# Altium schematic sheet debug.SchDoc: Scalony Skaner Bioimpedancji
size A4; DrawnBy: Łukasz Przeniosło; Organization: Zachodniopomorski; Address1: Uniwersytet Technologiczny; Address2: w Szczecinie; Address3: Wydział Elektryczny; Address4: Katedra KISSE; Revision: 1.0; SheetNumber: 7; SheetTotal: 7
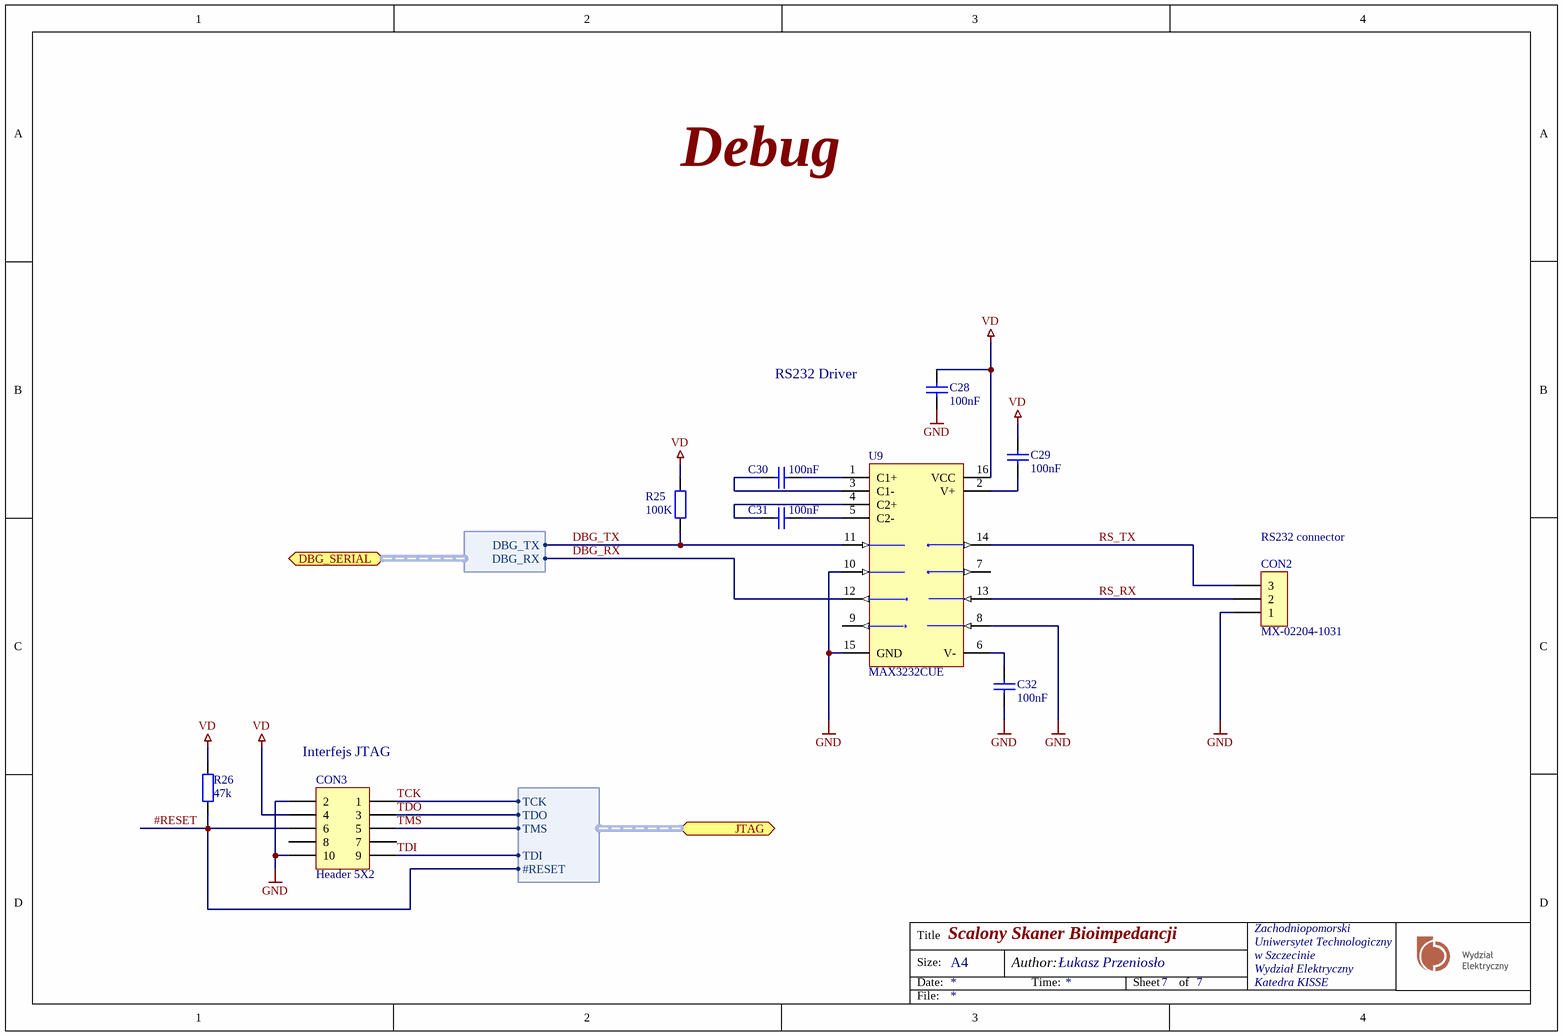
[diagram p0: debug.SchDoc]

## Parts
C28  100nF  [CAPC1608N]
C29  100nF  [CAPC1608N]
C30  100nF  [CAPC1608N]
C31  100nF  [CAPC1608N]
C32  100nF  [CAPC1608N]
CON2  MX-02204-1031  [MX-02204-1031]
CON3  Header 5X2  [918510X324]
R25  100K  [RESC1608N]
R26  47k  [RESC1608N]
U9  MAX3232CUE  [TI-D16_L_moje]

## Ports
DBG_SERIAL (harness DBG_SERIAL), JTAG (harness JTAG)

## Harnesses
DBG_SERIAL: DBG_TX, DBG_RX
JTAG: TMS, TCK, TDI, TDO, #RESET

## Nets
GND: C28.1 C32.1 CON2.1 CON3.2 CON3.10 U9.8(R2IN) U9.10(T2IN) U9.15(GND)
VD: C28.2 C29.2 CON3.4 R25.2 R26.2 U9.16(VCC)
#RESET: CON3.6 R26.1 ; port JTAG.#RESET
DBG_RX: U9.12(R1OUT) ; port DBG_SERIAL.DBG_RX
DBG_TX: R25.1 U9.11(T1IN) ; port DBG_SERIAL.DBG_TX
RS_RX: CON2.2 U9.13(R1IN)
RS_TX: CON2.3 U9.14(T1OUT)
TCK: CON3.1 ; port JTAG.TCK
TDI: CON3.9 ; port JTAG.TDI
TDO: CON3.3 ; port JTAG.TDO
TMS: CON3.5 ; port JTAG.TMS
NetC29_1: C29.1 U9.2(V+)
NetC30_1: C30.1 U9.3(C1-)
NetC30_2: C30.2 U9.1(C1+)
NetC31_1: C31.1 U9.4(C2+)
NetC31_2: C31.2 U9.5(C2-)
NetC32_2: C32.2 U9.6(V-)

Not connected (* = marked no-connect by the designer): CON3 7 8; U9 7(T2OUT) 9(R2OUT)

## Notes on the sheet
- Debug
- RS232 Driver
- (near CON2) RS232 connector
- (near CON3) Interfejs JTAG
- Title
- Size:
- Date:
- A4
- Author:
- Time:
- Sheet
- of
- File:

## Library data of the parts
C28-C32 = Capacitor: Value: 100nF
CON2 = MX-02204-1031: Pith 2.54mm, 3-pin; ComponentLink1Description: Manufacturer Link; ComponentLink2Description: Datasheet; Distributor: tme.pl; tme.pl: MX-6410-03A
CON3 = Header 5X2: Header, 5-Pin, Dual row; LatestRevisionDate: 17-Jul-2002; LatestRevisionNote: Re-released for DXP Platform.; Publisher: Altium Limited
R25 = Resistor: Power: 0W; Tolerance: 5%; Value: 100K
R26 = Resistor: Tolerance: 5%; Power: 0W; Value: 47k
U9 = MAX3232CUE: 3.0V TO 5.5V, Low-Power, up to 1Mbps, True RS-232 Transceiver Using Four 0.1µF External Capacitor; Published: 16-Jan-2001; LatestRevisionDate: 29-May-2009; LatestRevisionNote: IPC-7351 Footprint Added.; DatasheetVersion: Mar-1999; PackageVersion: 21-0066 C; PackageReference: TSSOP16; Publisher: Altium Limited; PackageDescription: 16-Pin Thin Small Outline Package 0.65 mm Pitch; ComponentLink1Description: Manufacturer Link; ComponentLink1URL: http://www.maxim-ic.com/; ComponentLink2Description: Datasheet; ComponentLink2URL: http://pdfserv.maxim-ic.com/en/ds/MAX3222-MAX3241.pdf